# Altium schematic sheet FTDI-support.SchDoc
size A4; SheetNumber: 3; SheetTotal: 6
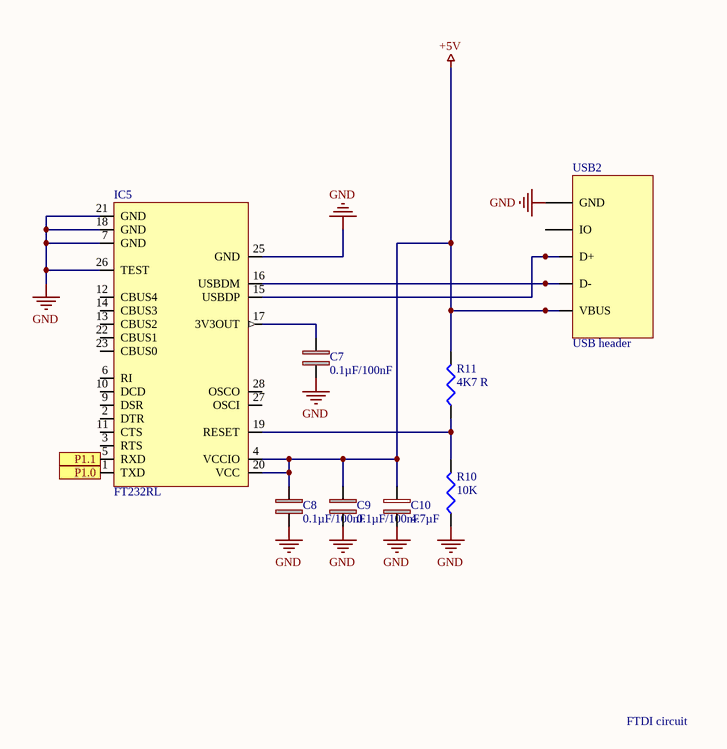
[diagram p0: FTDI-support.SchDoc]

## Parts
C7  0.1µF/100nF  [MC0603B104K250CT]
C8  0.1µF/100nF  [MC0603B104K250CT]
C9  0.1µF/100nF  [MC0603B104K250CT]
C10  4.7µF  [TMCUA1C475KTRF]
IC5  FT232RL  [SSOP28]
R10  10K  [RC0805]
R11  4K7 R  [PCF0603]
USB2  USB header  [Micro USB - Type B]

## Ports
P1.0, P1.1

## Nets
+5V: C8.1 C9.1 C10.2(+) IC5.4(VCCIO) IC5.20(VCC) R11.2 USB2.1(VBUS)
GND: C7.2 C8.2 C9.2 C10.1 IC5.7(GND) IC5.18(GND) IC5.21(GND) IC5.25(GND) IC5.26(TEST) R10.1 USB2.5(GND)
P1.0: IC5.1(TXD) ; port P1.0
P1.1: IC5.5(RXD) ; port P1.1
NetC7_1: C7.1 IC5.17(3V3OUT)
NetIC5_15: IC5.15(USBDP) USB2.3(D+)
NetIC5_16: IC5.16(USBDM) USB2.2(D-)
NetIC5_19: IC5.19(RESET) R10.2 R11.1

Not connected (* = marked no-connect by the designer): IC5 2(DTR) 3(RTS) 6(RI) 9(DSR) 10(DCD) 11(CTS) 12(CBUS4) 13(CBUS2) 14(CBUS3) 22(CBUS1) 23(CBUS0) 27(OSCI) 28(OSCO); USB2 4(IO)

## Notes on the sheet
- FTDI circuit

## Library data of the parts
C7-C9 = MC0603B104K250CT: Cap Ceramic 0.1uF 25V X7R 10% Pad SMD 0603 125C T/R; Manufacturer: Multicomp; Capacitance: 100nF; Supplier 1: Newark; Manufacturer Part Number: MC0603B104K250CT; RoHS: Yes; Category: Ceramic Capacitors; Stock 1: 124000; Pricing 1: 1=0,00300, 4000=0,00300, 8000=0,00300, 20000=0,00300 (USD); Case/Package: 0603; Number of Pins: 2; Case Code (Metric): 1608; Case Code (Imperial): 0603; Min Operating Temperature: -55°C; Max Operating Temperature: 125°C; Tolerance: 10%; Packaging: Cut Tape; Voltage Rating: 25V; Dielectric: X7R; Voltage Rating (DC): 25V; Series: MLCC; Width: 0.8mm; REACH SVHC: Unknown; RoHS Compliant: Yes; ComponentLink1URL: https://datasheet.ciiva.com/22686/1901289-22686277.pdf?src-supplier=Element14; ComponentLink1Description: https://datasheet.ciiva.com/22686/1901289-22686277.pdf?src-supplier=Element14; ComponentLink2URL: https://datasheet.ciiva.com/22648/1901289-22648410.pdf?src-supplier=Element14; ComponentLink2Description: https://datasheet.ciiva.com/22648/1901289-22648410.pdf?src-supplier=Element14; Supplier Part Number 1: 94W8728
C10 = TMCUA1C475KTRF: Cap Tant Solid 4.7uF 16V UA CASE 10% (3.2 X 1.6 X 1.2mm) Inward L SMD 3216-12 4 Ohm 125C T/R; Manufacturer: Vishay; ESR (Equivalent Series Resistance): 4R; Case/Category: 1206; Supplier 1: RSComponents; Manufacturer Part Number: TMCUA1C475KTRF; RoHS: Yes; Category: Tantalum Capacitors; Stock 1: 1; Pricing 1: 3000=0,10600, 6000=0,10300 (USD); Mount: Surface Mount; Case Code (Metric): 3216; Case Code (Imperial): 1206; Min Operating Temperature: -55°C; Max Operating Temperature: 125°C; Capacitance: 4.7uF; Voltage Rating: 16V; Packaging: Cut Tape; Tolerance: 10%; Voltage Rating (DC): 16V; REACH SVHC: Unknown; RoHS Compliant: Yes; ComponentLink1URL: http://www.farnell.com/datasheets/1948249.pdf?src-supplier=Farnell; ComponentLink1Description: http://www.farnell.com/datasheets/1948249.pdf?src-supplier=Farnell; ComponentLink2URL: http://www.farnell.com/datasheets/1948249.pdf?src-supplier=Element14; ComponentLink2Description: http://www.farnell.com/datasheets/1948249.pdf?src-supplier=Element14; Supplier Part Number 1: 1882042
IC5 = FT232RL: Usb Interface Ics Usb to Serial Uart 28 Pin SSOP; Manufacturer: FTDI; Min Supply Voltage: 1.8V; Max Supply Voltage: 5.25V; Data Rate: 3Mbps; Number of Drivers: 1; Voltage: 5V; Bandwidth: 48MHz; Nominal Supply Current: 15mA; Supplier 1: RSComponents; Manufacturer Part Number: FT232RL; RoHS: No; Category: Interface ICs; Stock 1: 12; Pricing 1: 1=4,97300, 20=4,11500, 100=3,90000, 500=3,61900, 1000=3,55200 (USD); Mount: Surface Mount; Case/Package: SSOP; Number of Pins: 28; Min Operating Temperature: -40°C; Max Operating Temperature: 85°C; Packaging: Cut Tape; Interface: UART; Number of Receivers: 1; Length: 10.2mm; Width: 5.3mm; Height: 1.75mm; REACH SVHC: No SVHC; Lead Free: Lead Free; ComponentLink1URL: https://datasheet.ciiva.com/14094/ft232r-eng-tds-14094039.pdf?src-supplier=Distrelec; ComponentLink1Description: https://datasheet.ciiva.com/14094/ft232r-eng-tds-14094039.pdf?src-supplier=Distrelec; Supplier Part Number 1: 0406580
R10 = RC0805FR-0710KL: Res SMD 0805 10K 1% 0.125W T.C.100PPM; Manufacturer: Yageo; Resistance: 10kR; Power Rating: 125mW; Voltage Rating: 150V; Temperature Coefficient: 100ppm/°C; Supplier 1: RSComponents; Manufacturer Part Number: RC0805FR-0710KL; RoHS: Yes; Category: Resistors; Stock 1: 435000; Pricing 1: 5000=0,00700 (USD); Case/Package: 0805; Case Code (Imperial): 0805; Case Code (Metric): 2012; Size Code: 0805; Min Operating Temperature: -55°C; Max Operating Temperature: 155°C; Packaging: Tape and Reel; Tolerance: 1%; Package Quantity: 1; Termination: SMD/SMT; Max Power Dissipation: 125mW; Resistor Type: Thick Film; Number of Terminations: 2; Series: RC; Construction: Rectangular; Resistance Tolerance: 1%; Technology: THICK FILM; Features: Moisture Resistant; Length: 2mm; Width: 0.049inch; Height: 0.024inch; Depth: 1.25mm; REACH SVHC: Unknown; Lead Free: Lead Free; Military Standard: Not; RoHS Compliant: Yes; ComponentLink1URL: https://datasheet.ciiva.com/11808/0900766b8106beab-11808151.pdf?src-supplier=RSComponents; ComponentLink1Description: https://datasheet.ciiva.com/11808/0900766b8106beab-11808151.pdf?src-supplier=RSComponents; ComponentLink2URL: https://datasheet.ciiva.com/12669/rc0805-12669688.pdf?src-supplier=Mouser; ComponentLink2Description: https://datasheet.ciiva.com/12669/rc0805-12669688.pdf?src-supplier=Mouser; ComponentLink3URL: https://datasheet.ciiva.com/46447/444164-46447563.pdf?src-supplier=Element14; ComponentLink3Description: https://datasheet.ciiva.com/46447/444164-46447563.pdf?src-supplier=Element14; ComponentLink4URL: https://datasheet.ciiva.com/2456/pyu-r-int-thick-7-2456972.pdf?src-supplier=Digi-Key; ComponentLink4Description: https://datasheet.ciiva.com/2456/pyu-r-int-thick-7-2456972.pdf?src-supplier=Digi-Key; ComponentLink5URL: https://datasheet.ciiva.com/2456/pyu-r-int-thick-7-2456973.pdf?src-supplier=Digi-Key; ComponentLink5Description: https://datasheet.ciiva.com/2456/pyu-r-int-thick-7-2456973.pdf?src-supplier=Digi-Key; ComponentLink6URL: https://datasheet.ciiva.com/2456/pyu-r-int-thick-7-2456974.pdf?src-supplier=Digi-Key; ComponentLink6Description: https://datasheet.ciiva.com/2456/pyu-r-int-thick-7-2456974.pdf?src-supplier=Digi-Key; ComponentLink7URL: https://datasheet.ciiva.com/16747/rc0805-16747087.pdf?src-supplier=Future+Electronics; ComponentLink7Description: https://datasheet.ciiva.com/16747/rc0805-16747087.pdf?src-supplier=Future+Electronics; Supplier Part Number 1: 6185163; Parameter 1: *
R11 = PCF0603P-R-4K7-BT1: Surface Mount Metal Film Resistor, Pcf Series, 4.7 Kohm, 63 Mw, - 0.1%, 75 V Rohs Compliant: Yes; Manufacturer: TT Welwyn; Power Rating: 63mW; Voltage Rating: 75V; Resistance: 4.7kR; Temperature Coefficient: 25ppm/°C; Case/Category: 0603; Supplier 1: Newark; Manufacturer Part Number: PCF0603P-R-4K7-BT1; RoHS: Yes; Category: Chip SMD Resistors; Stock 1: 1027; Pricing 1: 10=0,17900 (USD); Case Code (Imperial): 0603; Case Code (Metric): 1608; Tolerance: 0.1%; Packaging: Cut Tape; Resistor Type: Thin Film; Voltage Rating (DC): 75V; REACH SVHC: No SVHC; ComponentLink1URL: https://datasheet.ciiva.com/7860/3754-7860191.pdf?src-supplier=Element14; ComponentLink1Description: https://datasheet.ciiva.com/7860/3754-7860191.pdf?src-supplier=Element14; ComponentLink2URL: https://datasheet.ciiva.com/6093/3754-6093381.pdf?src-supplier=Farnell; ComponentLink2Description: https://datasheet.ciiva.com/6093/3754-6093381.pdf?src-supplier=Farnell; Supplier Part Number 1: 61M8292
USB2 = 61300411121: CONN HEADER 4 POS 2.54; Manufacturer: Wurth Electronics; Number of Contacts: 4; Gender: Male; Connector Type: Male Pin; Pitch: 0.1inch; Supplier 1: RSComponents; Manufacturer Part Number: 61300411121; RoHS: Yes; Category: Headers and Wire Housings; Stock 1: 380; Pricing 1: 5=0,19600, 250=0,08000, 500=0,07800, 2500=0,07500, 5000=0,07200 (USD); Mount: Through Hole; Contact Material: Copper; Color: Black; Contact Plating: Gold; Number of Rows: 1; Packaging: Bulk; Termination: Solder; Number of Positions: 4; Contact Mating Length: 0.236inch; REACH SVHC: Unknown; RoHS Compliant: Yes; Lead Free: Lead Free; ComponentLink1URL: http://www.farnell.com/cad/1737268.pdf?src-supplier=Element14; ComponentLink1Description: http://www.farnell.com/cad/1737268.pdf?src-supplier=Element14; ComponentLink2URL: https://katalog.we-online.de/em/datasheet/6130xx11121.pdf?src-supplier=Digi-Key; ComponentLink2Description: https://katalog.we-online.de/em/datasheet/6130xx11121.pdf?src-supplier=Digi-Key; Supplier Part Number 1: 8281594